# Altium schematic sheet voeding switcher.SchDoc
size A4; SheetNumber: 8; SheetTotal: 8
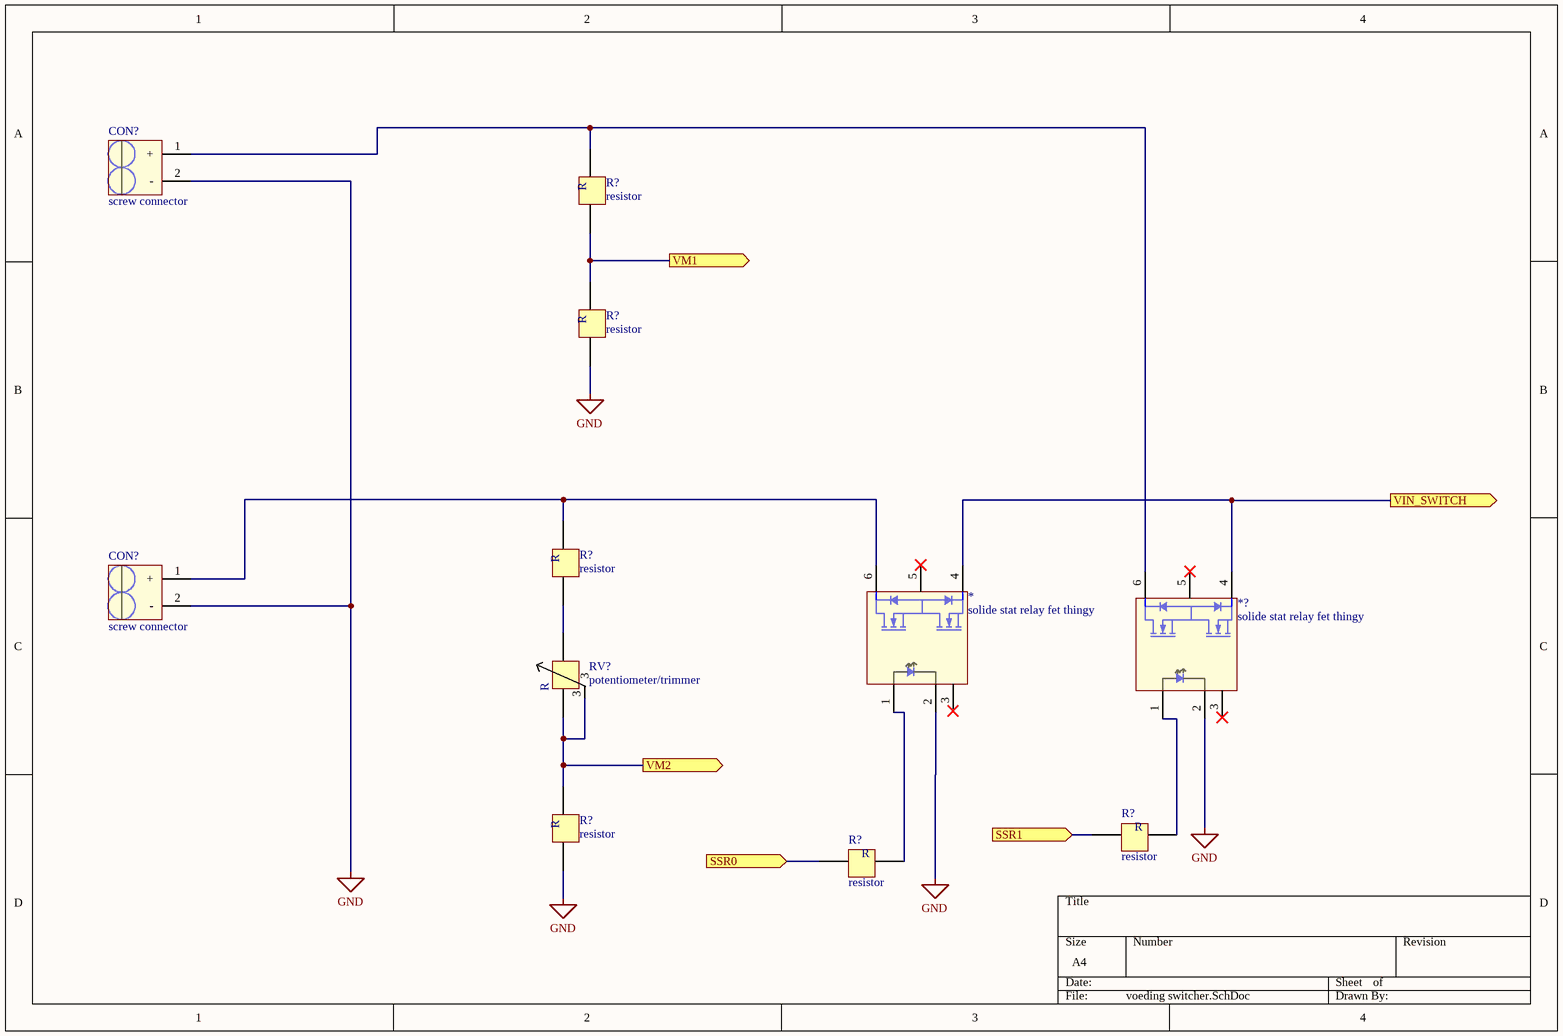
[diagram p0: voeding switcher.SchDoc]

## Parts
(Parts that share a designator on the sheet are numbered #1, #2 ... from top to bottom, then left to right.)
*  solide stat relay fet thingy
*?  solide stat relay fet thingy
CON?#1  screw connector
CON?#2  screw connector
R?#1  resistor  [CAPC1005X04L]
R?#2  resistor  [CAPC1005X04L]
R?#3  resistor  [CAPC1005X04L]
R?#4  resistor  [CAPC1005X04L]
R?#5  resistor  [CAPC1005X04L]
R?#6  resistor  [CAPC1005X04L]
RV?  potentiometer/trimmer

## Ports
SSR0 (in), SSR1 (in), VIN_SWITCH (out), VM1 (out), VM2 (out)

## Nets
GND: *.2 *?.2 CON?#1.2(-) CON?#2.2(-) R?#2.2 R?#4.2
SSR0: R?#6.2 ; port SSR0
SSR1: R?#5.2 ; port SSR1
VIN_SWITCH: *.4 *?.4 ; port VIN_SWITCH
VM1: R?#1.2 R?#2.1 ; port VM1
VM2: R?#4.1 RV?.2 RV?.3 ; port VM2
Net*?_1: *?.1 R?#5.1
Net*?_6: *?.6 CON?#1.1(+) R?#1.1
Net*_1: *.1 R?#6.1
Net*_6: *.6 CON?#2.1(+) R?#3.1
NetR?#3_2: R?#3.2 RV?.1

Not connected (* = marked no-connect by the designer): * 3* 5*; *? 3* 5*

## Notes on the sheet
- (in symbol potentiometer/trimmer) R
- (in symbol resistor) R